# EAGLE schematic batsim (EAGLE 7.7.0)

## Sheet 1 of 4
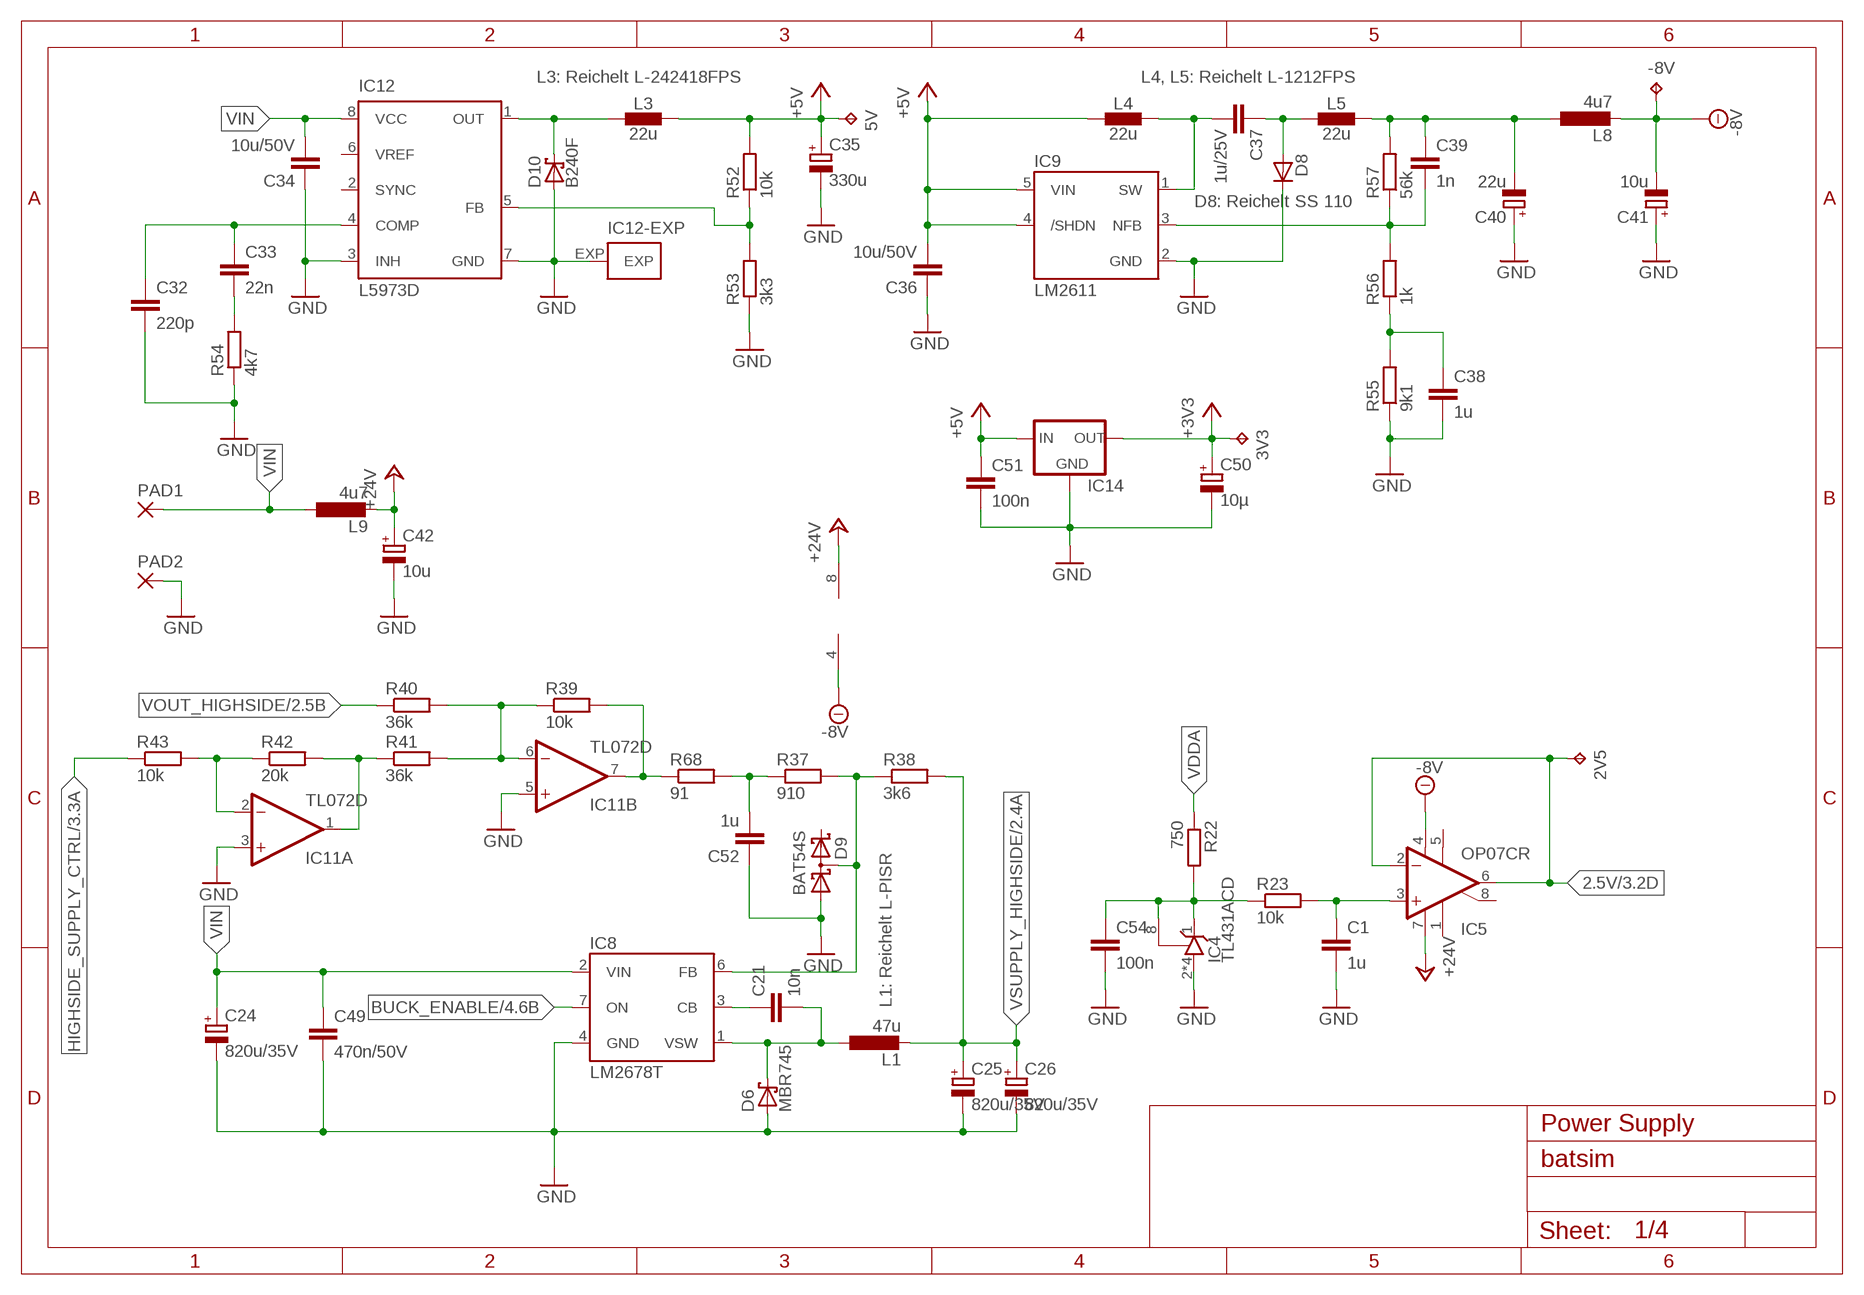
[diagram p0: schematic, sheet 1]

### Parts
2V5  TPB1,27  [B1,27]
3V3  TPB1,27  [B1,27]
5V  TPB1,27  [B1,27]
-8V  TPB1,27  [B1,27]
C1  1u  C-EUC0603  [C0603]
C21  10n  C-EUC0603  [C0603]
C24  820u/35V  CPOL-EUE5-10.5  [E5-10,5]
C25  820u/35V  CPOL-EUE5-10.5  [E5-10,5]
C26  820u/35V  CPOL-EUE5-10.5  [E5-10,5]
C32  220p  C-EUC0603  [C0603]
C33  22n  C-EUC0603  [C0603]
C34  10u/50V  C-EUC1206  [C1206]
C35  330u  CPOL-EU153CLV-0605  [153CLV-0605]
C36  10u/50V  C-EUC1206  [C1206]
C37  1u/25V  C-EUC1206  [C1206]
C38  1u  C-EUC0603  [C0603]
C39  1n  C-EUC0603  [C0603]
C40  22u  CPOL-EU153CLV-0505  [153CLV-0505]
C41  10u  CPOL-EU153CLV-0405  [153CLV-0405]
C42  10u  CPOL-EU153CLV-0505  [153CLV-0505]
C49  470n/50V  C-EUC1206  [C1206]
C50  10µ  CPOL-EUSMCA  [SMC_A]
C51  100n  C-EUC0603  [C0603]
C52  1u  C-EUC0603  [C0603]
C54  100n  C-EUC0603  [C0603]
D6  MBR745  [TO220ACS]
D8  D-SMA  [SMA]
D9  BAT54S  [SOT23]
D10  B240F  SCHOTTKY-DIODESMD  [SMB]
IC4  TL431ACD  [SO8]
IC5  OP07CR  [SO08]
IC8  LM2678T  [TO220-7]
IC9  LM2611  [SOT23-5]
IC11  TL072D  [SO08]
IC12  L5973D  [HSOP8]
IC14  LM1117  [SOT223]
L1  47u  L-EUPISR  [PISR]
L3  22u  INDUCTOR-NR60XX  [L_NR60XX]
L4  22u  INDUCTOR-1212  [L_1212]
L5  22u  INDUCTOR-1212  [L_1212]
L8  4u7  L-EUL2012C  [L2012C]
L9  4u7  L-EUL2012C  [L2012C]
PAD1  3,81/1,4  [3,81/1,4]
PAD2  3,81/1,4  [3,81/1,4]
R22  750  R-EU_R0603  [R0603]
R23  10k  R-EU_R0603  [R0603]
R37  910  R-EU_R0603  [R0603]
R38  3k6  R-EU_R0603  [R0603]
R39  10k  R-EU_R0603  [R0603]
R40  36k  R-EU_R0603  [R0603]
R41  36k  R-EU_R0603  [R0603]
R42  20k  R-EU_R0603  [R0603]
R43  10k  R-EU_R0603  [R0603]
R52  10k  R-EU_R0603  [R0603]
R53  3k3  R-EU_R0603  [R0603]
R54  4k7  R-EU_R0603  [R0603]
R55  9k1  R-EU_R0603  [R0603]
R56  1k  R-EU_R0603  [R0603]
R57  56k  R-EU_R0603  [R0603]
R68  91  R-EU_R0603  [R0603]

### Nets
2.5V: 2V5.TP IC5.2(-IN) IC5.6(OUT) ; also sheet 3,4
+3V3: 3V3.TP C50.+ IC14.2(OUT) ; also sheet 3,4
+5V: 5V.TP C35.+ C36.2 C51.1 IC9.4(/SHDN) IC9.5(VIN) IC14.3(IN) L3.2 L4.1 R52.2 ; also sheet 4
+24V: C42.+ IC5.7(V+) IC11.8(P:V+) L9.2 ; also sheet 2,3
-8V: -8V.TP C41.- IC5.4(V-) IC11.4(P:V-) L8.2 ; also sheet 2,3
BUCK_ENABLE: IC8.7(ON) ; also sheet 4
GND: C1.2 C24.- C25.- C26.- C32.2 C34.1 C35.- C36.1 C38.2 C40.+ C41.+ C42.- C49.2 C50.- C51.2 C52.1 C54.2 D6.A D8.C D9.1(A1) D10.A IC4.2(A) IC4.3(A) IC4.6(A) IC4.7(A) IC8.4(GND) IC9.2(GND) IC11.3(A:+IN) IC11.5(B:+IN) IC12.3(INH) IC12.7(GND) IC12.EXP IC14.1(GND) PAD2.1(P) R53.1 R54.1 R55.1 ; also sheet 2,3,4
HIGHSIDE_SUPPLY_CTRL: R43.1 ; also sheet 3
LM2611_SW: C37.2 IC9.1(SW) L4.2
N$8: C54.1 IC4.1(C) IC4.8(R) R22.2 R23.1
N$23: C1.1 IC5.3(+IN) R23.2
N$30: C32.1 C33.1 IC12.4(COMP)
N$41: C21.2 D6.C IC8.1(VSW) L1.1
N$43: C21.1 IC8.3(CB)
N$44: D9.3(C1A2) IC8.6(FB) R37.2 R38.1
N$45: IC11.7(B:OUT) R39.2 R68.1
N$46: IC11.6(B:-IN) R39.1 R40.2 R41.2
N$47: IC11.1(A:OUT) R41.1 R42.2
N$48: IC11.2(A:-IN) R42.1 R43.2
N$49: C33.2 R54.2
N$52: D10.C IC12.1(OUT) L3.1
N$53: C39.1 C40.- L5.2 L8.1 R57.2
N$54: IC12.5(FB) R52.1 R53.2
N$56: C37.1 D8.A L5.1
N$57: C39.2 IC9.3(NFB) R56.2 R57.1
N$58: C38.1 R55.2 R56.1
N$62: C52.2 R37.1 R68.2
VDDA: R22.1 ; also sheet 4
VIN: C24.+ C34.2 C49.1 IC8.2(VIN) IC12.8(VCC) L9.1 PAD1.1(P)
VOUT_HIGHSIDE: R40.1 ; also sheet 2
VSUPPLY_HIGHSIDE: C25.+ C26.+ L1.2 R38.2 ; also sheet 2,3
Unconnected: D9.2(C2) IC5.1(ON1) IC5.5(OPT) IC5.8(ON2) IC12.2(SYNC) IC12.6(VREF)

### Notes on the sheet
- L3: Reichelt L-242418FPS | L4, L5: Reichelt L-1212FPS
- D8: Reichelt SS 110
- L1: Reichelt L-PISR
- Power Supply

## Sheet 2 of 4
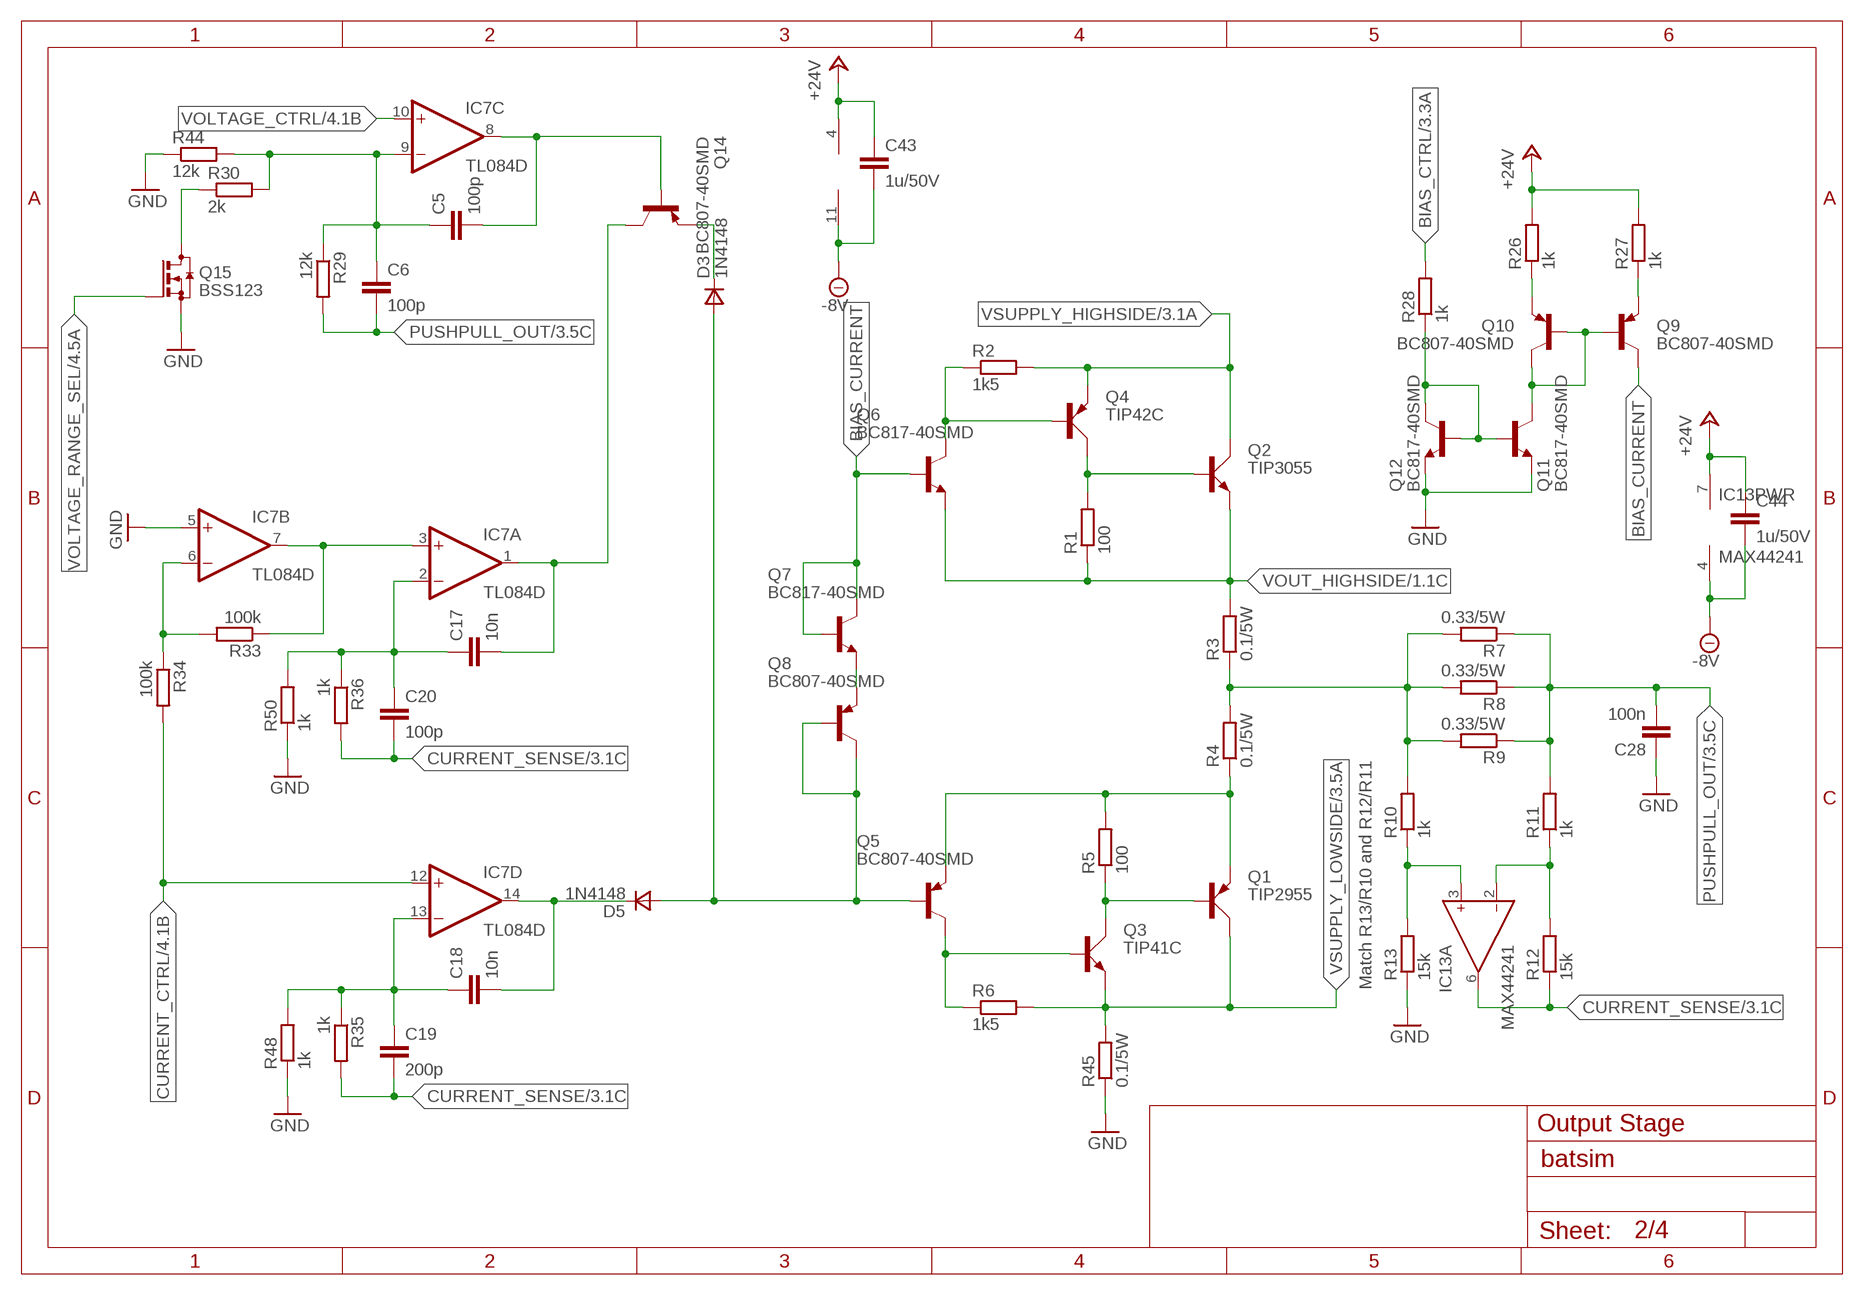
[diagram p1: schematic, sheet 2]

### Parts
C5  100p  C-EUC0603  [C0603]
C6  100p  C-EUC0603  [C0603]
C17  10n  C-EUC0603  [C0603]
C18  10n  C-EUC0603  [C0603]
C19  200p  C-EUC0603  [C0603]
C20  100p  C-EUC0603  [C0603]
C28  100n  C-EUC1206  [C1206]
C43  1u/50V  C-EUC0603  [C0603]
C44  1u/50V  C-EUC0603  [C0603]
D3  1N4148  DSOD323  [SOD323]
D5  1N4148  DSOD323  [SOD323]
IC7  TL084D  [SO14]
IC13  MAX44241  [UMAX8]
Q1  TIP2955  [TOP3AV]
Q2  TIP3055  [TOP3AV]
Q3  TIP41C  [TO220AV]
Q4  TIP42C  [TO220AV]
Q5  BC807-40SMD  [SOT23-BEC]
Q6  BC817-40SMD  [SOT23-BEC]
Q7  BC817-40SMD  [SOT23-BEC]
Q8  BC807-40SMD  [SOT23-BEC]
Q9  BC807-40SMD  [SOT23-BEC]
Q10  BC807-40SMD  [SOT23-BEC]
Q11  BC817-40SMD  [SOT23-BEC]
Q12  BC817-40SMD  [SOT23-BEC]
Q14  BC807-40SMD  [SOT23-BEC]
Q15  BSS123  [SOT23]
R1  100  R-EU_R0603  [R0603]
R2  1k5  R-EU_R0603  [R0603]
R3  0.1/5W  5WAXIAL  [5WAXIAL]
R4  0.1/5W  5WAXIAL  [5WAXIAL]
R5  100  R-EU_R0603  [R0603]
R6  1k5  R-EU_R0603  [R0603]
R7  0.33/5W  5WAXIAL  [5WAXIAL]
R8  0.33/5W  5WAXIAL  [5WAXIAL]
R9  0.33/5W  5WAXIAL  [5WAXIAL]
R10  1k  R-EU_R0603  [R0603]
R11  1k  R-EU_R0603  [R0603]
R12  15k  R-EU_R0603  [R0603]
R13  15k  R-EU_R0603  [R0603]
R26  1k  R-EU_R0603  [R0603]
R27  1k  R-EU_R0603  [R0603]
R28  1k  R-EU_R0603  [R0603]
R29  12k  R-EU_R0603  [R0603]
R30  2k  R-EU_R0603  [R0603]
R33  100k  R-EU_R0603  [R0603]
R34  100k  R-EU_R0603  [R0603]
R35  1k  R-EU_R0603  [R0603]
R36  1k  R-EU_R0603  [R0603]
R44  12k  R-EU_R0603  [R0603]
R45  0.1/5W  5WAXIAL  [5WAXIAL]
R48  1k  R-EU_R0603  [R0603]
R50  1k  R-EU_R0603  [R0603]

### Nets
+24V: C43.1 C44.1 IC7.4(P:V+) IC13.7(PWR:V+) R26.2 R27.2 ; also sheet 1,3
-8V: C43.2 C44.2 IC7.11(P:V-) IC13.4(PWR:V-) ; also sheet 1,3
BIAS_CTRL: R28.2 ; also sheet 3
BIAS_CURRENT: Q6.B Q7.B Q7.C Q9.C
CURRENT_CTRL: IC7.12(D:+IN) R34.2 ; also sheet 4
CURRENT_SENSE: C19.2 C20.2 IC13.6(A:OUT) R12.1 R35.2 R36.2 ; also sheet 3
GND: C28.1 IC7.5(B:+IN) Q11.E Q12.E Q15.2(S) R13.1 R44.1 R45.1 R48.1 R50.1 ; also sheet 1,3,4
N$1: Q15.3(D) R30.1
N$2: Q2.B Q4.C R1.2
N$3: Q4.B Q6.C R2.1
N$5: R3.1 R4.2 R7.2 R8.2 R9.2 R10.2
N$6: Q1.E Q5.E R4.1 R5.2
N$7: Q1.B Q3.C R5.1
N$9: Q3.B Q5.C R6.1
N$10: Q7.E Q8.E
N$12: D3.1(C) Q14.E
N$14: IC13.3(A:IN+) R10.1 R13.2
N$15: IC13.2(A:IN-) R11.1 R12.2
N$24: Q9.B Q10.B Q10.C Q11.C
N$25: Q11.B Q12.B Q12.C R28.1
N$28: Q10.E R26.1
N$29: Q9.E R27.1
N$31: C5.2 IC7.8(C:OUT) Q14.B
N$36: IC7.6(B:-IN) R33.2 R34.1
N$37: IC7.3(A:+IN) IC7.7(B:OUT) R33.1
N$38: C18.2 D5.1(C) IC7.14(D:OUT)
N$39: C18.1 C19.1 IC7.13(D:-IN) R35.1 R48.2
N$40: C17.2 IC7.1(A:OUT) Q14.C
N$42: C17.1 C20.1 IC7.2(A:-IN) R36.1 R50.2
PUSHPULL_CTRL: D3.2(A) D5.2(A) Q5.B Q8.B Q8.C
PUSHPULL_OUT: C6.2 C28.2 R7.1 R8.1 R9.1 R11.2 R29.2 ; also sheet 3
VOLTAGE_CTRL: IC7.10(C:+IN) ; also sheet 4
VOLTAGE_FEEDBACK: C5.1 C6.1 IC7.9(C:-IN) R29.1 R30.2 R44.2
VOLTAGE_RANGE_SEL: Q15.1(G) ; also sheet 4
VOUT_HIGHSIDE: Q2.E Q6.E R1.1 R3.2 ; also sheet 1
VSUPPLY_HIGHSIDE: Q2.C Q4.E R2.2 ; also sheet 1,3
VSUPPLY_LOWSIDE: Q1.C Q3.E R6.2 R45.2 ; also sheet 3

### Notes on the sheet
- Match R13/R10 and R12/R11
- Output Stage

## Sheet 3 of 4
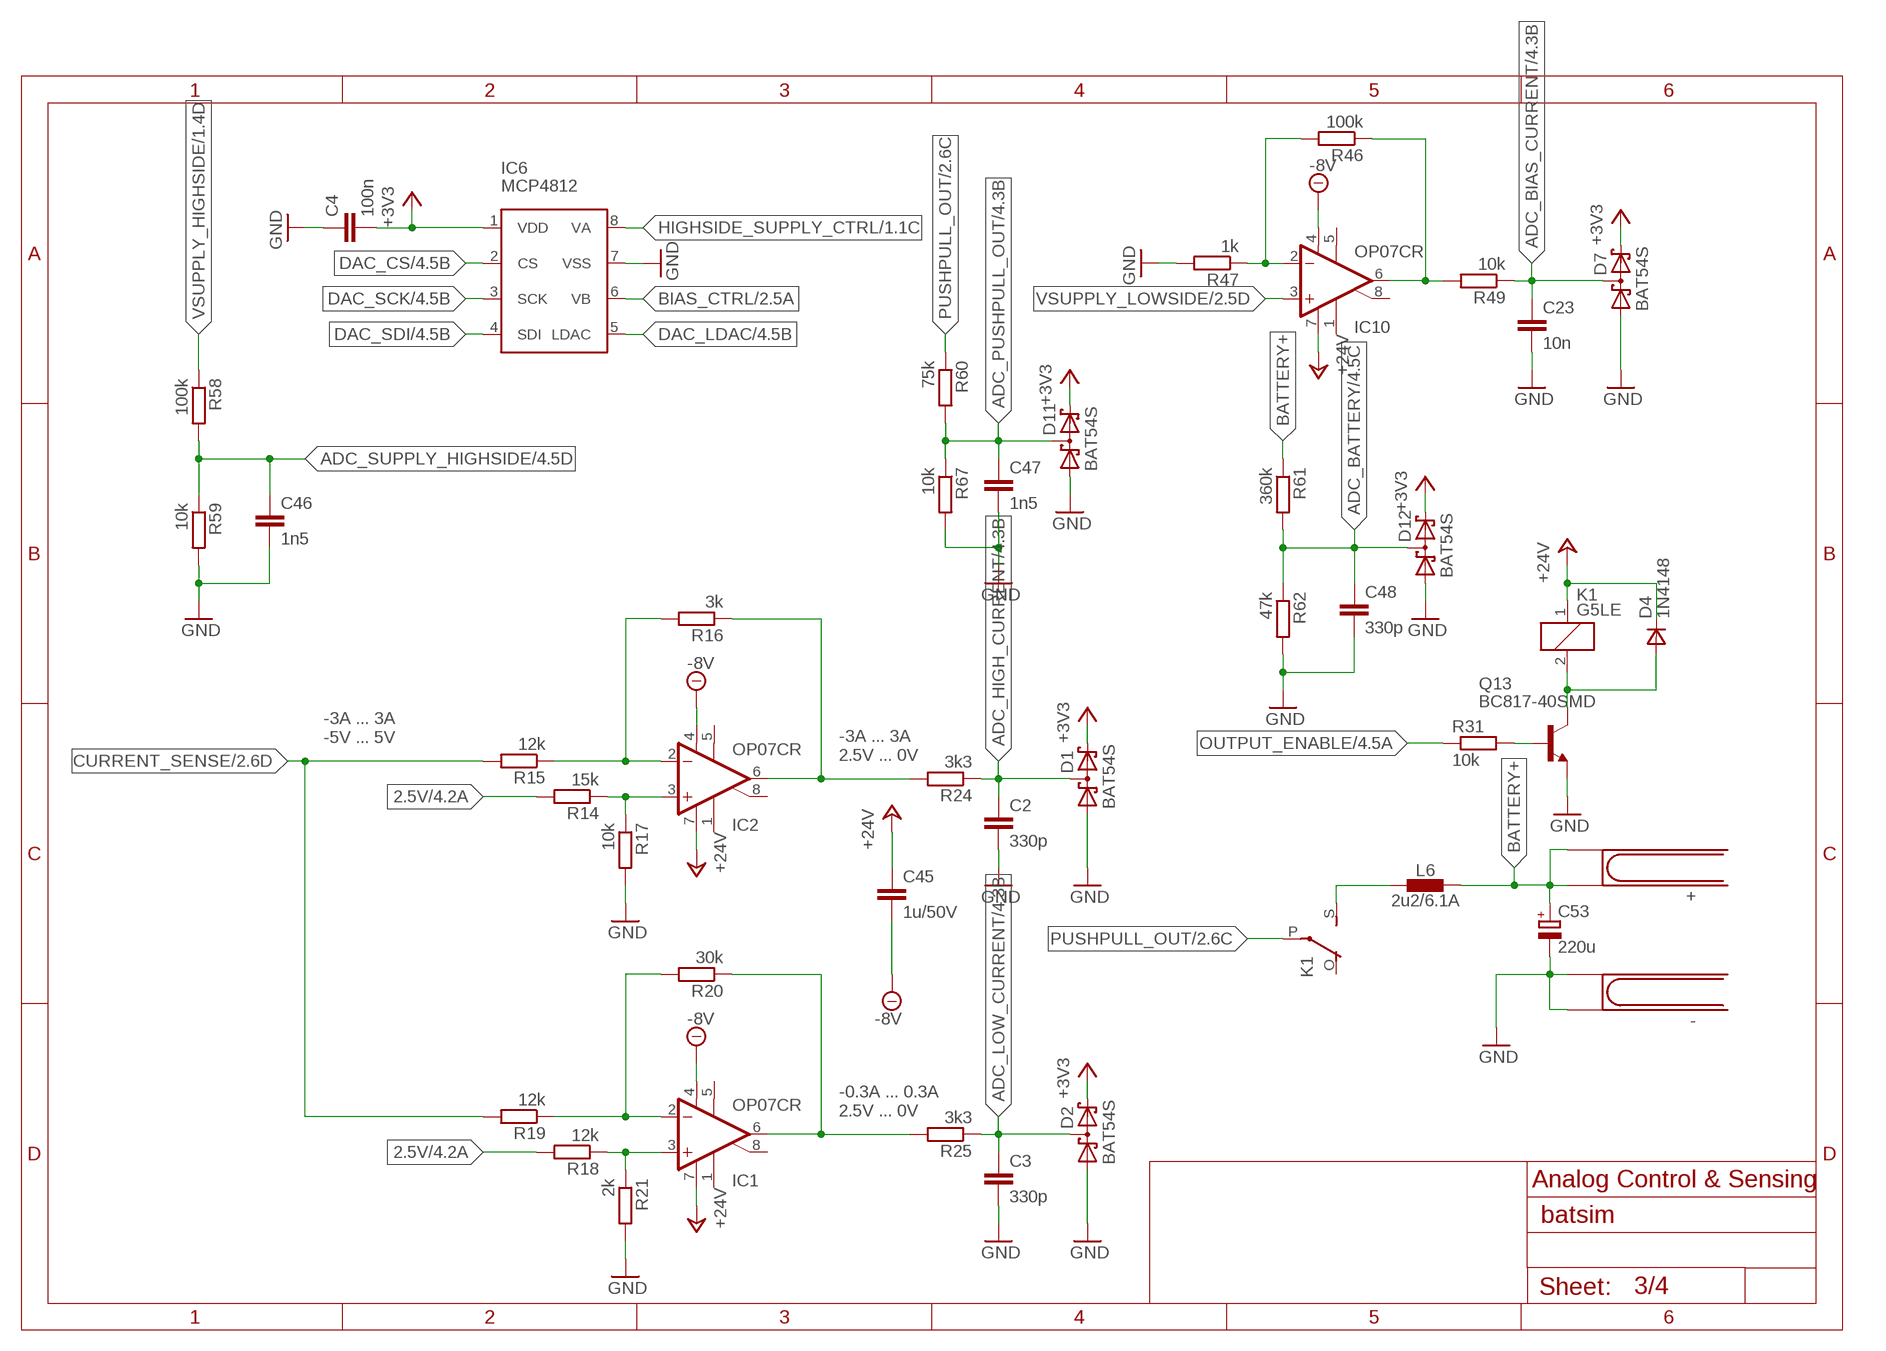
[diagram p2: schematic, sheet 3]

### Parts
+  4MMJACK  [4MMJACK]
-  4MMJACK  [4MMJACK]
C2  330p  C-EUC0603  [C0603]
C3  330p  C-EUC0603  [C0603]
C4  100n  C-EUC0603  [C0603]
C23  10n  C-EUC0603  [C0603]
C45  1u/50V  C-EUC0603  [C0603]
C46  1n5  C-EUC0603  [C0603]
C47  1n5  C-EUC0603  [C0603]
C48  330p  C-EUC0603  [C0603]
C53  220u  CPOL-EUE5-10.5  [E5-10,5]
D1  BAT54S  [SOT23]
D2  BAT54S  [SOT23]
D4  1N4148  DSOD323  [SOD323]
D7  BAT54S  [SOT23]
D11  BAT54S  [SOT23]
D12  BAT54S  [SOT23]
IC1  OP07CR  [SO08]
IC2  OP07CR  [SO08]
IC6  MCP4812  [SO08]
IC10  OP07CR  [SO08]
K1  G5LE  [G5LE]
L6  2u2/6.1A  INDUCTOR-NR60XX  [L_NR60XX]
Q13  BC817-40SMD  [SOT23-BEC]
R14  15k  R-EU_R0603  [R0603]
R15  12k  R-EU_R0603  [R0603]
R16  3k  R-EU_R0603  [R0603]
R17  10k  R-EU_R0603  [R0603]
R18  12k  R-EU_R0603  [R0603]
R19  12k  R-EU_R0603  [R0603]
R20  30k  R-EU_R0603  [R0603]
R21  2k  R-EU_R0603  [R0603]
R24  3k3  R-EU_R0603  [R0603]
R25  3k3  R-EU_R0603  [R0603]
R31  10k  R-EU_R0603  [R0603]
R46  100k  R-EU_R0603  [R0603]
R47  1k  R-EU_R0603  [R0603]
R49  10k  R-EU_R0603  [R0603]
R58  100k  R-EU_R0603  [R0603]
R59  10k  R-EU_R0603  [R0603]
R60  75k  R-EU_R0603  [R0603]
R61  360k  R-EU_R0603  [R0603]
R62  47k  R-EU_R0603  [R0603]
R67  10k  R-EU_R0603  [R0603]

### Nets
2.5V: R14.2 R18.2 ; also sheet 1,4
+3V3: C4.2 D1.2(C2) D2.2(C2) D7.2(C2) D11.2(C2) D12.2(C2) IC6.1(VDD) ; also sheet 1,4
+24V: C45.1 D4.1(C) IC1.7(V+) IC2.7(V+) IC10.7(V+) K1.1 ; also sheet 1,2
-8V: C45.2 IC1.4(V-) IC2.4(V-) IC10.4(V-) ; also sheet 1,2
ADC_BATTERY: C48.1 D12.3(C1A2) R61.2 R62.1 ; also sheet 4
ADC_BIAS_CURRENT: C23.1 D7.3(C1A2) R49.1 ; also sheet 4
ADC_HIGH_CURRENT: C2.1 D1.3(C1A2) R24.1 ; also sheet 4
ADC_LOW_CURRENT: C3.1 D2.3(C1A2) R25.1 ; also sheet 4
ADC_PUSHPULL_OUT: C47.1 D11.3(C1A2) R60.2 R67.1 ; also sheet 4
ADC_SUPPLY_HIGHSIDE: C46.1 R58.2 R59.1 ; also sheet 4
BATTERY+: +.1@1 +.1@2 C53.+ L6.2 R61.1
BIAS_CTRL: IC6.6(VB) ; also sheet 2
CURRENT_SENSE: R15.2 R19.2 ; also sheet 2
DAC_CS: IC6.2(CS) ; also sheet 4
DAC_LDAC: IC6.5(LDAC) ; also sheet 4
DAC_SCK: IC6.3(SCK) ; also sheet 4
DAC_SDI: IC6.4(SDI) ; also sheet 4
GND: -.1@1 -.1@2 C2.2 C3.2 C4.1 C23.2 C46.2 C47.2 C48.2 C53.- D1.1(A1) D2.1(A1) D7.1(A1) D11.1(A1) D12.1(A1) IC6.7(VSS) Q13.E R17.2 R21.2 R47.2 R59.2 R62.2 R67.2 ; also sheet 1,2,4
HIGHSIDE_SUPPLY_CTRL: IC6.8(VA) ; also sheet 1
N$4: IC10.2(-IN) R46.2 R47.1
N$11: IC10.6(OUT) R46.1 R49.2
N$13: D4.2(A) K1.2 Q13.C
N$16: IC2.3(+IN) R14.1 R17.1
N$17: IC2.2(-IN) R15.1 R16.2
N$18: IC2.6(OUT) R16.1 R24.2
N$20: IC1.3(+IN) R18.1 R21.1
N$21: IC1.2(-IN) R19.1 R20.2
N$22: IC1.6(OUT) R20.1 R25.2
N$26: Q13.B R31.2
N$73: K1.S(2:S) L6.1
OUTPUT_ENABLE: R31.1 ; also sheet 4
PUSHPULL_OUT: K1.P(2:P) R60.1 ; also sheet 2
VSUPPLY_HIGHSIDE: R58.1 ; also sheet 1,2
VSUPPLY_LOWSIDE: IC10.3(+IN) ; also sheet 2
Unconnected: IC1.1(ON1) IC1.5(OPT) IC1.8(ON2) IC2.1(ON1) IC2.5(OPT) IC2.8(ON2) IC10.1(ON1) IC10.5(OPT) IC10.8(ON2) K1.O(2:O)

### Notes on the sheet
- -3A ... 3A
  -5V ... 5V
- -3A ... 3A
  2.5V ... 0V
- -0.3A ... 0.3A
  2.5V ... 0V
- Analog Control & Sensing

## Sheet 4 of 4
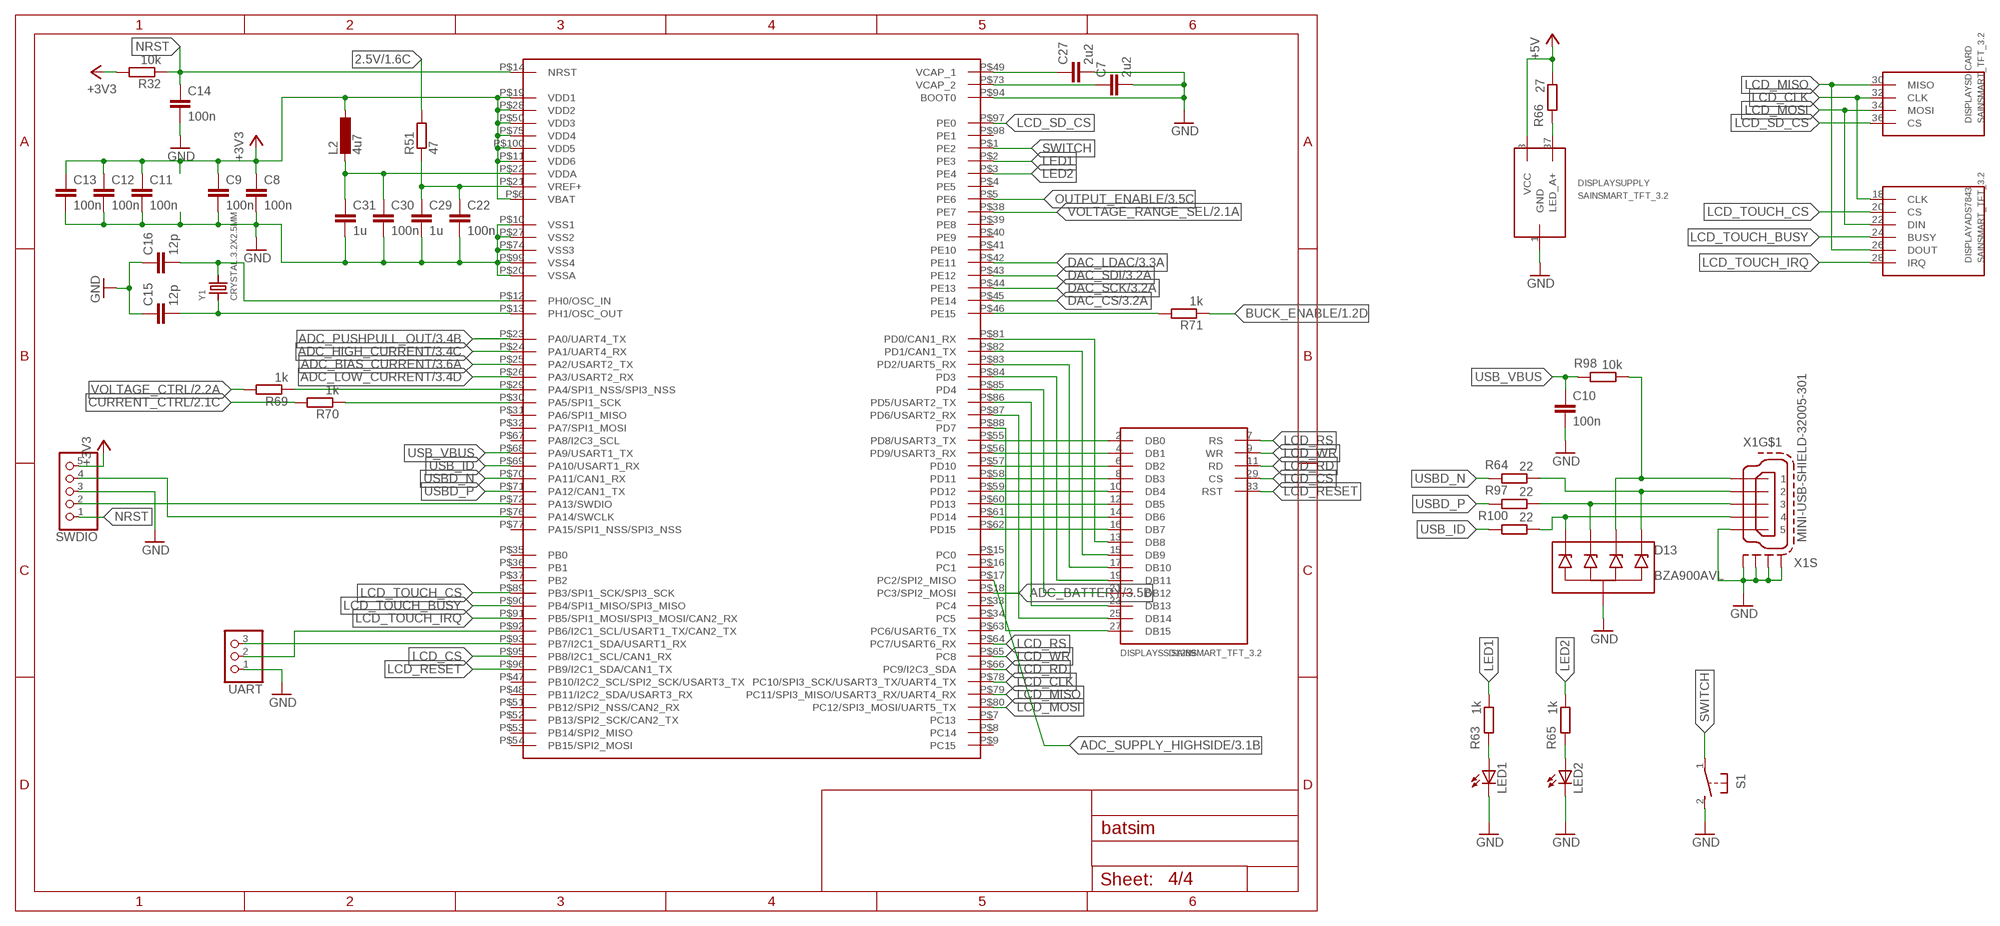
[diagram p3: schematic, sheet 4]

### Parts
C7  2u2  C-EUC1206  [C1206]
C8  100n  C-EUC0603  [C0603]
C9  100n  C-EUC0603  [C0603]
C10  100n  C-EUC0603K  [C0603K]
C11  100n  C-EUC0603  [C0603]
C12  100n  C-EUC0603  [C0603]
C13  100n  C-EUC0603  [C0603]
C14  100n  C-EUC0603  [C0603]
C15  12p  C-EUC0603  [C0603]
C16  12p  C-EUC0603  [C0603]
C22  100n  C-EUC0603  [C0603]
C27  2u2  C-EUC1206  [C1206]
C29  1u  C-EUC0603  [C0603]
C30  100n  C-EUC0603  [C0603]
C31  1u  C-EUC0603  [C0603]
D13  BZA900AVL  [SOT-665]
DISPLAY  SAINSMART_TFT_3.2  [SAINSMART_TFT_3.2]
L2  4u7  L-EUL2012C  [L2012C]
LED1  LEDCHIP-LED0603  [CHIP-LED0603]
LED2  LEDCHIP-LED0603  [CHIP-LED0603]
R32  10k  R-EU_R0603  [R0603]
R51  47  R-EU_R0603  [R0603]
R63  1k  R-EU_R0603  [R0603]
R64  22  R-EU_R0603  [R0603]
R65  1k  R-EU_R0603  [R0603]
R66  27  R-EU_R0603  [R0603]
R69  1k  R-EU_R0603  [R0603]
R70  1k  R-EU_R0603  [R0603]
R71  1k  R-EU_R0603  [R0603]
R97  22  R-EU_R0603  [R0603]
R98  10k  R-EU_R0603  [R0603]
R100  22  R-EU_R0603  [R0603]
S1  31-XX  [B3F-31XX]
SWDIO  PINHD-1X5  [1X05]
U$1  STM32F407X100  [LQFP100_14]
UART  PINHD-1X3  [1X03]
X1  MINI-USB-SHIELD-32005-301  MINI-USB-SCHIELD-32005-301  [32005-301]
Y1  CRYSTAL.3.2X2.5MM  [3.2X2.5MM]

### Nets
2.5V: R51.2 ; also sheet 1,3
+3V3: C8.1 C9.1 C11.1 C12.1 C13.1 L2.1 R32.2 SWDIO.5 U$1.P$6(VBAT) U$1.P$11(VDD6) U$1.P$19(VDD1) U$1.P$28(VDD2) U$1.P$50(VDD3) U$1.P$75(VDD4) U$1.P$100(VDD5) ; also sheet 1,3
+5V: DISPLAY.3(SUPPLY:VCC) R66.1 ; also sheet 1
ADC_BATTERY: U$1.P$18(PC3/SPI2_MOSI) ; also sheet 3
ADC_BIAS_CURRENT: U$1.P$25(PA2/USART2_TX) ; also sheet 3
ADC_HIGH_CURRENT: U$1.P$24(PA1/UART4_RX) ; also sheet 3
ADC_LOW_CURRENT: U$1.P$26(PA3/USART2_RX) ; also sheet 3
ADC_PUSHPULL_OUT: U$1.P$23(PA0/UART4_TX) ; also sheet 3
ADC_SUPPLY_HIGHSIDE: U$1.P$17(PC2/SPI2_MISO) ; also sheet 3
BUCK_ENABLE: R71.1 ; also sheet 1
CURRENT_CTRL: R70.2 ; also sheet 2
DAC_CS: U$1.P$45(PE14) ; also sheet 3
DAC_LDAC: U$1.P$42(PE11) ; also sheet 3
DAC_SCK: U$1.P$44(PE13) ; also sheet 3
DAC_SDI: U$1.P$43(PE12) ; also sheet 3
GND: C7.2 C8.2 C9.2 C10.2 C11.2 C12.2 C13.2 C14.2 C15.1 C16.1 C22.2 C27.2 C29.2 C30.2 C31.2 D13.2(COM) DISPLAY.1(SUPPLY:GND) LED1.C LED2.C S1.2(S) SWDIO.3 U$1.P$10(VSS1) U$1.P$20(VSSA) U$1.P$27(VSS2) U$1.P$74(VSS3) U$1.P$94(BOOT0) U$1.P$99(VSS4) UART.1 X1.5 X1.M1(S:S1) X1.M2(S:S2) X1.M3(S:S3) X1.M4(S:S4) ; also sheet 1,2,3
LCD_CLK: DISPLAY.18(ADS7843:CLK) DISPLAY.32(SD-CARD:CLK) U$1.P$78(PC10/SPI3_SCK/USART3_TX/UART4_TX)
LCD_CS: DISPLAY.29(SSD1289:CS) U$1.P$95(PB8/I2C1_SCL/CAN1_RX)
LCD_MISO: DISPLAY.26(ADS7843:DOUT) DISPLAY.30(SD-CARD:MISO) U$1.P$79(PC11/SPI3_MISO/USART3_RX/UART4_RX)
LCD_MOSI: DISPLAY.22(ADS7843:DIN) DISPLAY.34(SD-CARD:MOSI) U$1.P$80(PC12/SPI3_MOSI/UART5_TX)
LCD_RD: DISPLAY.11(SSD1289:RD) U$1.P$66(PC9/I2C3_SDA)
LCD_RESET: DISPLAY.33(SSD1289:RST) U$1.P$96(PB9/I2C1_SDA/CAN1_TX)
LCD_RS: DISPLAY.7(SSD1289:RS) U$1.P$64(PC7/USART6_RX)
LCD_SD_CS: DISPLAY.36(SD-CARD:CS) U$1.P$97(PE0)
LCD_TOUCH_BUSY: DISPLAY.24(ADS7843:BUSY) U$1.P$90(PB4/SPI1_MISO/SPI3_MISO)
LCD_TOUCH_CS: DISPLAY.20(ADS7843:CS) U$1.P$89(PB3/SPI1_SCK/SPI3_SCK)
LCD_TOUCH_IRQ: DISPLAY.28(ADS7843:IRQ) U$1.P$91(PB5/SPI1_MOSI/SPI3_MOSI/CAN2_RX)
LCD_WR: DISPLAY.9(SSD1289:WR) U$1.P$65(PC8)
LED1: R63.1 U$1.P$2(PE3)
LED2: R65.1 U$1.P$3(PE4)
N$27: SWDIO.4 U$1.P$76(PA14/SWCLK)
N$32: D13.3 R97.1 X1.3
N$33: C16.2 U$1.P$12(PH0/OSC_IN) Y1.3
N$34: C15.2 U$1.P$13(PH1/OSC_OUT) Y1.1
N$35: SWDIO.2 U$1.P$72(PA13/SWDIO)
N$50: C27.1 U$1.P$49(VCAP_1)
N$51: C7.1 U$1.P$73(VCAP_2)
N$55: D13.5 R64.1 X1.2
N$59: D13.4 R98.1 X1.1
N$60: D13.1 R100.1 X1.4
N$61: DISPLAY.37(SUPPLY:LED_A+) R66.2
N$63: DISPLAY.2(SSD1289:DB0) U$1.P$55(PD8/USART3_TX)
N$64: DISPLAY.4(SSD1289:DB1) U$1.P$56(PD9/USART3_RX)
N$65: DISPLAY.6(SSD1289:DB2) U$1.P$57(PD10)
N$66: DISPLAY.8(SSD1289:DB3) U$1.P$58(PD11)
N$67: DISPLAY.10(SSD1289:DB4) U$1.P$59(PD12)
N$68: DISPLAY.12(SSD1289:DB5) U$1.P$60(PD13)
N$69: DISPLAY.14(SSD1289:DB6) U$1.P$61(PD14)
N$70: DISPLAY.16(SSD1289:DB7) U$1.P$62(PD15)
N$71: LED1.A R63.2
N$72: LED2.A R65.2
N$74: R69.1 U$1.P$29(PA4/SPI1_NSS/SPI3_NSS)
N$75: DISPLAY.19(SSD1289:DB11) U$1.P$84(PD3)
N$76: DISPLAY.17(SSD1289:DB10) U$1.P$83(PD2/UART5_RX)
N$77: DISPLAY.15(SSD1289:DB9) U$1.P$82(PD1/CAN1_TX)
N$78: DISPLAY.13(SSD1289:DB8) U$1.P$81(PD0/CAN1_RX)
N$79: R70.1 U$1.P$30(PA5/SPI1_SCK)
N$80: R71.2 U$1.P$46(PE15)
N$83: DISPLAY.21(SSD1289:DB12) U$1.P$85(PD4)
N$84: DISPLAY.23(SSD1289:DB13) U$1.P$86(PD5/USART2_TX)
N$85: DISPLAY.25(SSD1289:DB14) U$1.P$87(PD6/USART2_RX)
N$86: DISPLAY.27(SSD1289:DB15) U$1.P$88(PD7)
NRST: C14.1 R32.1 SWDIO.1 U$1.P$14(NRST)
OUTPUT_ENABLE: U$1.P$5(PE6) ; also sheet 3
RX: U$1.P$93(PB7/I2C1_SDA/USART1_RX) UART.3
SWITCH: S1.1(P) U$1.P$1(PE2)
TX: U$1.P$92(PB6/I2C1_SCL/USART1_TX/CAN2_TX) UART.2
USB_ID: R100.2 U$1.P$69(PA10/USART1_RX)
USB_VBUS: C10.1 R98.2 U$1.P$68(PA9/USART1_TX)
USBD_N: R64.2 U$1.P$70(PA11/CAN1_RX)
USBD_P: R97.2 U$1.P$71(PA12/CAN1_TX)
VDDA: C30.1 C31.1 L2.2 U$1.P$22(VDDA) ; also sheet 1
VOLTAGE_CTRL: R69.2 ; also sheet 2
VOLTAGE_RANGE_SEL: U$1.P$38(PE7) ; also sheet 2
VREF: C22.1 C29.1 R51.1 U$1.P$21(VREF+)
Unconnected: U$1.P$4(PE5) U$1.P$7(PC13) U$1.P$8(PC14) U$1.P$9(PC15) U$1.P$15(PC0) U$1.P$16(PC1) U$1.P$31(PA6/SPI1_MISO) U$1.P$32(PA7/SPI1_MOSI) U$1.P$33(PC4) U$1.P$34(PC5) U$1.P$35(PB0) U$1.P$36(PB1) U$1.P$37(PB2) U$1.P$39(PE8) U$1.P$40(PE9) U$1.P$41(PE10) U$1.P$47(PB10/I2C2_SCL/SPI2_SCK/USART3_TX) U$1.P$48(PB11/I2C2_SDA/USART3_RX) U$1.P$51(PB12/SPI2_NSS/CAN2_RX) U$1.P$52(PB13/SPI2_SCK/CAN2_TX) U$1.P$53(PB14/SPI2_MISO) U$1.P$54(PB15/SPI2_MOSI) U$1.P$63(PC6/USART6_TX) U$1.P$67(PA8/I2C3_SCL) U$1.P$77(PA15/SPI1_NSS/SPI3_NSS) U$1.P$98(PE1)

## Library data of the parts
2V5 3V3 5V -8V = testpad:TP: Test pad
+ - = dmm:4MMJACK
C1-C23 C27-C34 C36-C39 C43-C49 C51 C52 C54 = rcl:C-EU: CAPACITOR, European symbol
C24-C26 C35 C40-C42 C53 = resistor:CPOL-EU: POLARIZED CAPACITOR, European symbol
C50 = rcl:CPOL-EU: POLARIZED CAPACITOR, European symbol
D1 D2 D7 D9 D11 D12 = diode:BAT54S: Schottky Diodes Pin connection corrected 2011-05-04 Source: Fairchild .. BAT54.pdf
D3-D5 = zetex:D: DIODE; MPN: CDSOD323-T05C; OC_FARNELL: 1824860; OC_NEWARK: 79R6078
D6 = custom-diode:MBR745
D8 = diodes:D-: DIODE
D10 = diode:SCHOTTKY-DIODE: Schottky Diode
D13 = esddiodes:BZA900AVL
DISPLAY = sainsmart:SAINSMART_TFT_3.2
IC1 IC2 IC5 IC10 = linear:OP07*: OP AMP
IC4 = custom-ref:TL431
IC6 = dac:MCP48: 12-Bit Dual Voltage Output Digital-to-Analog Converter with Internal VREF and SPI Interface Datasheet: \dac-datasheets\MCP4822.pdf Features • MCP4802: Dual 8-Bit Voltage Output DAC • MCP4812: Dual 10-Bit Voltage Output DAC • MCP4822: Dual 12-Bit Voltage Output DAC • Rail-to-Rail Output • SPI Interface with 20 MHz Clock Support • Simultaneous Latching of the Dual DACs with LDAC pin • Fast Settling Time of 4.5 μs • Selectable Unity or 2x Gain Output • 2.048V Internal Voltage Reference • 50ppm/°C VREF Temperature Coefficient • 2.7V to 5.5V Single-Supply Operation • Extended Temperature Range: -40°C to +125°C Applications • Set Point or Offset Trimming • Sensor Calibration • Precision Selectable Voltage Reference • Portable Instrumentation (Battery-Powered) • Calibration of Optical Communication Devices Description The MCP4802/4812/4822 devices are dual 8-bit, 10-bit and 12-bit buffered voltage output Digital-to-Analog Converters (DACs), respectively. The devices operate from a single 2.7V to 5.5V supply with SPI compatible Serial Peripheral Interface. The devices have a high precision internal voltage reference (VREF = 2.048V). The user can configure the full-scale range of the device to be 2.048V or 4.096V by setting the Gain Selection Option bit (gain of 1 of 2). Each DAC channel can be operated in Active or Shutdown mode individually by setting the Configuration register bits. In Shutdown mode, most of the internal circuits in the shutdown channel are turned off for power savings and the output amplifier is configured to present a known high resistance output load (500 kOhm typical. The devices include double-buffered registers, allowing synchronous updates of two DAC outputs using the LDAC pin. These devices also incorporate a Power-on Reset (POR) circuit to ensure reliable powerup. The devices utilize a resistive string architecture, with its inherent advantages of low DNL error, low ratio metric temperature coefficient and fast settling time. These devices are specified over the extended temperature range (+125°C). The devices provide high accuracy and low noise performance for consumer and industrial applications where calibration or compensation of signals (such as temperature, pressure and humidity) are required. The MCP4802/4812/4822 devices are available in the PDIP, SOIC and MSOP packages.; MPN: MCP4822-E/SN; OC_FARNELL: 1834912; PACKAGE: SO08; SUPPLIER: MICROCHIP
IC7 = linear:TL084: OP AMP
IC8 = v-reg-3:LM2678: National Semiconductor <http://www.national.com> 5.0A "Simple Switcher"(c) 260kHz, Vout 1.2-37V, Vin 40V, 120mOhm DMOS switch, 50µA standby current
IC9 = v-reg-3:LM2611
IC11 = linear:TL072: OP AMP
IC12 = st-microelectronics:L5973D: 2.5 A switch step down switching regulator Source: Data sheet <http://www.st.com/internet/com/TECHNICAL_RESOURCES/TECHNICAL_LITERATURE/DATASHEET/CD00002851.pdf>; MF: STMICROELECTRONICS; MPN: L5973D; OC_FARNELL: 1077145
IC13 = custom-op:MAX44241
IC14 = v-reg-3:LM1117
K1 = relay:G5LE: RELAY 1 x switch, 10 A/120 V AC, 8 A/30 V DC, Omron; OC_FARNELL: unknown; OC_NEWARK: unknown
L1 = inductor-Fastron:L-EU
L2 L8 L9 = rcl:L-EU: INDUCTOR, European symbol
L3-L6 = we-power:INDUCTOR: Power Inductors Taiyo Yuden NR6028 NR6028T0R9N - 0.9uH, Ir=6.6A NR6028T1R5N - 1.5uH, Ir=5.0A NR6028T2R2N - 2.2uH, Ir=4.2A NR6028T3R0N - 3.0uH, Ir=3.6A NR6028T4R7M - 4.7uH, Ir=2.7A NR6028T6R0M - 6.0uH, Ir=2.5A NR6028T100M - 10uH, Ir=1.9A NR6028T150M - 15uH, Ir=1.6A NR6028T220M - 22uH, Ir=1.3A NR6028T330M - 33uH, Ir=1.1A NR6028T470M - 47uH, Ir=0.95A NR6028T680M - 68uH, Ir=0.76A NR6028T101M - 100uH, Ir=0.62A Taiyo Yuden NR6045 NR6045T1R0N - 1.0uH, Ir=8.5A NR6045T1R3N - 1.3uH, Ir=8.0A NR6045T1R8N - 1.8uH, Ir=7.0A NR6045T2R3N - 2.3uH, Ir=6.0A NR6045T3R0N - 3.0uH, Ir=5.0A NR6045T4R5M - 4.5uH, Ir=4.0A NR6045T6R3M - 6.3uH, Ir=3.8A NR6045T100M - 10uH, Ir=3.0A NR6045T150M - 15uH, Ir=2.3A NR6045T220M - 22uH, Ir=1.9A NR6045T330M - 33uH, Ir=1.5A NR6045T470M - 47uH, Ir=1.3A NR6045T680M - 68uH, Ir=1.0A NR6045T101M - 100uH, Ir=0.8A
LED1 LED2 = led:LED: LED OSRAM: - CHIPLED LG R971, LG N971, LY N971, LG Q971, LY Q971, LO R971, LY R971 LH N974, LH R974 LS Q976, LO Q976, LY Q976 LO Q996 - Hyper CHIPLED LW Q18S LB Q993, LB Q99A, LB R99A - SideLED LS A670, LO A670, LY A670, LG A670, LP A670 LB A673, LV A673, LT A673, LW A673 LH A674 LY A675 LS A676, LA A676, LO A676, LY A676, LW A676 LS A679, LY A679, LG A679 - Hyper Micro SIDELED® LS Y876, LA Y876, LO Y876, LY Y876 LT Y87S - SmartLED LW L88C, LW L88S LB L89C, LB L89S, LG L890 LS L89K, LO L89K, LY L89K LS L896, LA L896, LO L896, LY L896 - TOPLED LS T670, LO T670, LY T670, LG T670, LP T670 LSG T670, LSP T670, LSY T670, LOP T670, LYG T670 LG T671, LOG T671, LSG T671 LB T673, LV T673, LT T673, LW T673 LH T674 LS T676, LA T676, LO T676, LY T676, LB T676, LH T676, LSB T676, LW T676 LB T67C, LV T67C, LT T67C, LS T67K, LO T67K, LY T67K, LW E67C LS E67B, LA E67B, LO E67B, LY E67B, LB E67C, LV E67C, LT E67C LW T67C LS T679, LY T679, LG T679 LS T770, LO T770, LY T770, LG T770, LP T770 LB T773, LV T773, LT T773, LW T773 LH T774 LS E675, LA E675, LY E675, LS T675 LS T776, LA T776, LO T776, LY T776, LB T776 LHGB T686 LT T68C, LB T68C - Hyper Mini TOPLED® LB M676 - Mini TOPLED Santana® LG M470 LS M47K, LO M47K, LY M47K Source: http://www.osram.convergy.de LUXEON: - LUMILED® LXK2-PW12-R00, LXK2-PW12-S00, LXK2-PW14-U00, LXK2-PW14-V00 LXK2-PM12-R00, LXK2-PM12-S00, LXK2-PM14-U00 LXK2-PE12-Q00, LXK2-PE12-R00, LXK2-PE12-S00, LXK2-PE14-T00, LXK2-PE14-U00 LXK2-PB12-K00, LXK2-PB12-L00, LXK2-PB12-M00, LXK2-PB14-N00, LXK2-PB14-P00, LXK2-PB14-Q00 LXK2-PR12-L00, LXK2-PR12-M00, LXK2-PR14-Q00, LXK2-PR14-R00 LXK2-PD12-Q00, LXK2-PD12-R00, LXK2-PD12-S00 LXK2-PH12-R00, LXK2-PH12-S00 LXK2-PL12-P00, LXK2-PL12-Q00, LXK2-PL12-R00 Source: www.luxeon.com KINGBRIGHT: KA-3528ASYC Source: www.kingbright.com
PAD1 PAD2 = wirepad:3,81/1,4: THROUGH-HOLE PAD
Q1 = transistor-power:TIP2955: PNP TRANSISTOR
Q2 = transistor-power:TIP3055: NPN TRANSISTOR
Q3 = transistor-power:TIP41C: NPN TRANSISTOR
Q4 = transistor-power:TIP42C: PNP TRANSISTOR
Q5 Q8-Q10 Q14 = transistor-pnp:BC807*: PNP Transistror
Q6 Q7 Q11-Q13 = transistor-npn:BC817*: NPN Transistor
Q15 = transistor-small-signal:BSS123: N-CHANNEL MOS FET
R1 R2 R5 R6 R10-R44 R46-R71 R97 R98 R100 = resistor:R-EU_: RESISTOR, European symbol
R3 R4 R7-R9 R45 = resistormod:5WAXIAL
S1 = switch-omron:31-XX: OMRON SWITCH; MPN: B3F-3100; OC_FARNELL: 959704; OC_NEWARK: 36M3582
SWDIO = pinhead:PINHD-1X5: PIN HEADER
U$1 = STM32_Lib:STM32F407X100
UART = pinhead:PINHD-1X3: PIN HEADER
X1 = con-cypressindustries:MINI-USB-SCHIELD-: MINI USB-B Conector Source: www.cypressindustries.com; OC_FARNELL: unknown; OC_NEWARK: unknown
Y1 = abracon:CRYSTAL